# Altium schematic sheet PIR Sensor driver v5-Cheburan.SchDoc: PIR Universal Interface Board
size A4; Version: 4.0; Variant: Driver for PIR 501 Sensor; Modification: Mod; Project: Sensors; PageSetup: Record=PageOptions|CenterHorizontal=True|CenterVertical=True|PrintScale=0.97|XCorrection=1.00|YCorrection=1.00|PrintKind=1|BorderSize=5000000|LeftOffset=0|BottomOffset=0|Orientation=2|PaperLength=2970|PaperWidth=2100|Scale=100|PaperSource=7|PrintQuality=-4|MediaType=1|DitherType=10|PaperKind=A4|PrintScaleMode=1
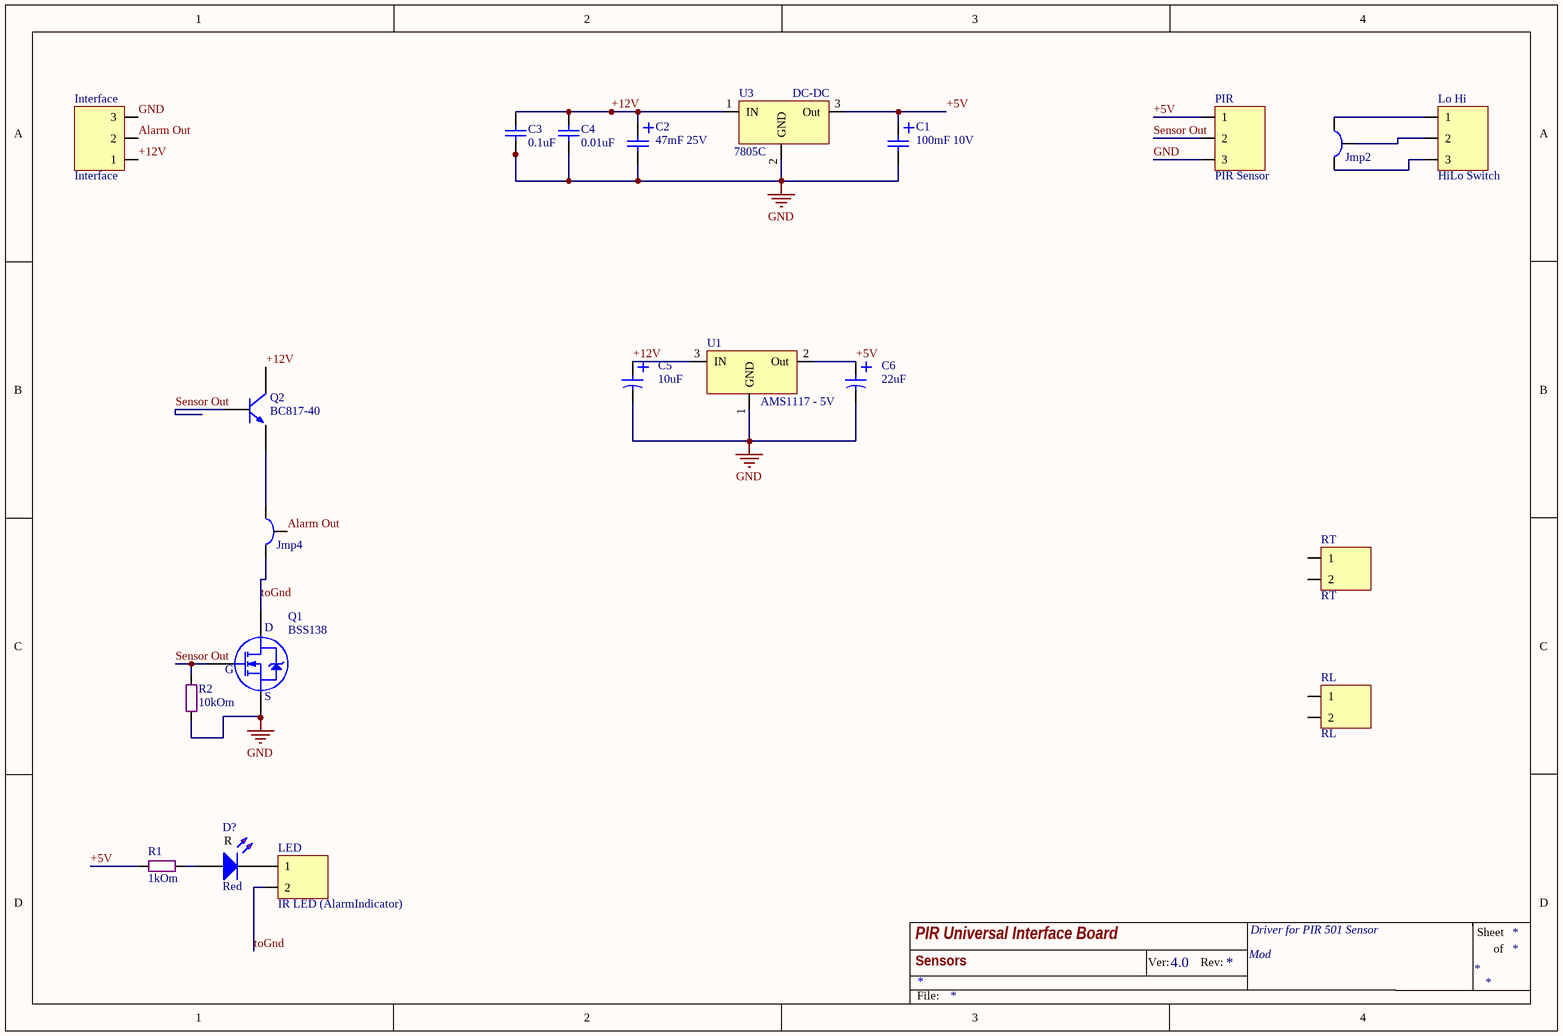
[diagram p0: PIR Sensor driver v5-Cheburan.SchDoc]

## Parts
C1  100mF 10V  [Cap E p1.5mm D4xH8 (2p)]
C2  47mF 25V  [Cap E p1.5mm D4xH8 (2p)]
C3  0.1uF  [SMD 0805 (2012)]
C4  0.01uF  [SMD 0805 (2012)]
C5  10uF  [SMD 1206 Tantal (3216)]
C6  22uF  [SMD 3528 Tantal (1210)]
D?  Red  [LED SMD 0805 Red]
Interface  Interface  [Line 2.54 X 3]
Jmp2  Jumper_3pos  [Jumper 3pos]  (value not drawn)
Jmp4  Jumper_3pos  [Jumper 3pos]  (value not drawn)
LED  IR LED (AlarmIndicator)  [Line 2.54 x 2]
Lo_Hi  HiLo Switch  [Line 2.54 X 3]
PIR  PIR Sensor  [Line 2.54 X 3]
Q1  BSS138  [SOT-23]
Q2  BC817-40  [SOT-23]
R1  1kOm  [SMD 0805 (2012)]
R2  10kOm  [SMD 0805 (2012)]
RL  RL  [Line 2.54 x 2]
RT  RT  [Line 2.54 x 2]
U1  AMS1117 - 5V  [SOT-223-3 (AMS)]
U3  7805C  V Out: +4,8..5,2V  [D-PAK]

## Nets
GND: C1.2 C2.2 C3.2 C4.2 C5.GND C6.GND Interface.3 PIR.3 Q1.3(S) R2.1 U1.1(GND) U3.2(GND)
+5V: C1.1 C6.VCC PIR.1 R1.1 U1.2(Out) U3.3(Out)
+12V: C2.1 C3.1 C4.1 C5.VCC Interface.1 Q2.3(C) U1.3(IN) U3.1(IN)
Alarm Out: Interface.2 Jmp4.2
Sensor Out: PIR.2 Q1.1(G) Q2.1(B) R2.2
toGnd: Jmp4.3 LED.2 Q1.2(D)
NetD?_A: D?.A R1.2
NetD?_K: D?.K LED.1
NetJmp2_1: Jmp2.1 Lo_Hi.1
NetJmp2_2: Jmp2.2 Lo_Hi.2
NetJmp2_3: Jmp2.3 Lo_Hi.3
NetJmp4_1: Jmp4.1 Q2.2(E)

Not connected (* = marked no-connect by the designer): RL 1 2; RT 1 2

## Notes on the sheet
- (near U3) DC-DC
- Ver:
- Rev:
- Sheet
- of
- File:
- (in symbol Led SMD Red) R

## Library data of the parts
C1 = Cap E 100mF x 10V: Capacitor
C2 = Cap E 47mF x 25V: Capacitor
C3 C4 = Cap SMD 0402-1812: Capacitor
C5 C6 = Cap Tantal: Capacitor
D? = Led SMD Red: ?2v ?20mA; Forward Voltage TYP: ?2; Resistor for 5v VCC: 330 Om; Forward Voltage Min: ?; Wave len min/typ: ?; Liminous Min (mcd): ?; Liminous Typ (mcd): ?; Forward Amp (mA): ?; Color: Red
Interface Lo_Hi PIR = PLS-3: Vert, Sgl line, Male
LED RL RT = PLS-2: Vert, Sgl line, Male
Q1 = BSS138: N-Channel 50V - 0.7-1Ω - 0.22A; Monufacturer: Farchild; V DSS (v): 60; RDS: <6Om; I d - Drain current (continuous) at TC = 100°C: 50 A; I d - Drain current (continuous) at TC = 25°C: 0.22 A; Name: BSS138; Datasheet: http://tec.org.ru/board/0-0-0-511-20
Q2 = BC817-40: NPN 45 V, 500 mA NPN general-purpose transistor; type: 45 V, 500 mA NPN general-purpose transistors; Name: BC817-40; url: http://lib.chipdip.ru/156/DOC000156781.pdf
R1 R2 = Res All Types
U1 = AMS1117_FIX: Voltage Regulator SOT-223-3; I output (A): 1; Max Voltage In (V): 15; t: -40...+125°C; Name: AMS1117 1.5 / 1.8 / 2.5 / 2.85 / 3.3 / 5.0; Dropuot: 1-1.3V; Capacitors: In: 10mF; Out: 22mF; V Out: 1.5 / 1.8 / 2.5 / 2.85 / 3.3 / 5.0; Case: SOT-223; Dtatsheet: https://lib.chipdip.ru/029/DOC001029248.pdf
U3 = 7805C: Voltage Regulator; Manufacturer: Интеграл; I output (A): 1; Max Voltage In (V): 35; Напряжение выход-вход (dropout): >2V; t: -10..+70°C; Case: D2PAK; Shema: http://tec.org.ru/_bd/5/57349922.jpg; Name: 7805C